# Altium schematic sheet NodoWifi.SchDoc
size A
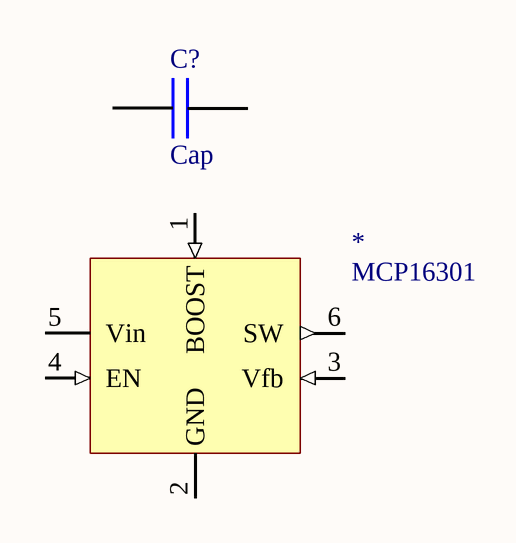
[diagram p0: NodoWifi.SchDoc]

## Parts
*  MCP16301
C?  Cap

## Nets

Not connected (* = marked no-connect by the designer): * 1(BOOST) 2(GND) 3(Vfb) 4(EN) 5(Vin) 6(SW); C? 1 2